# EAGLE design rfm69_32u4 (EAGLE 8.2.2)
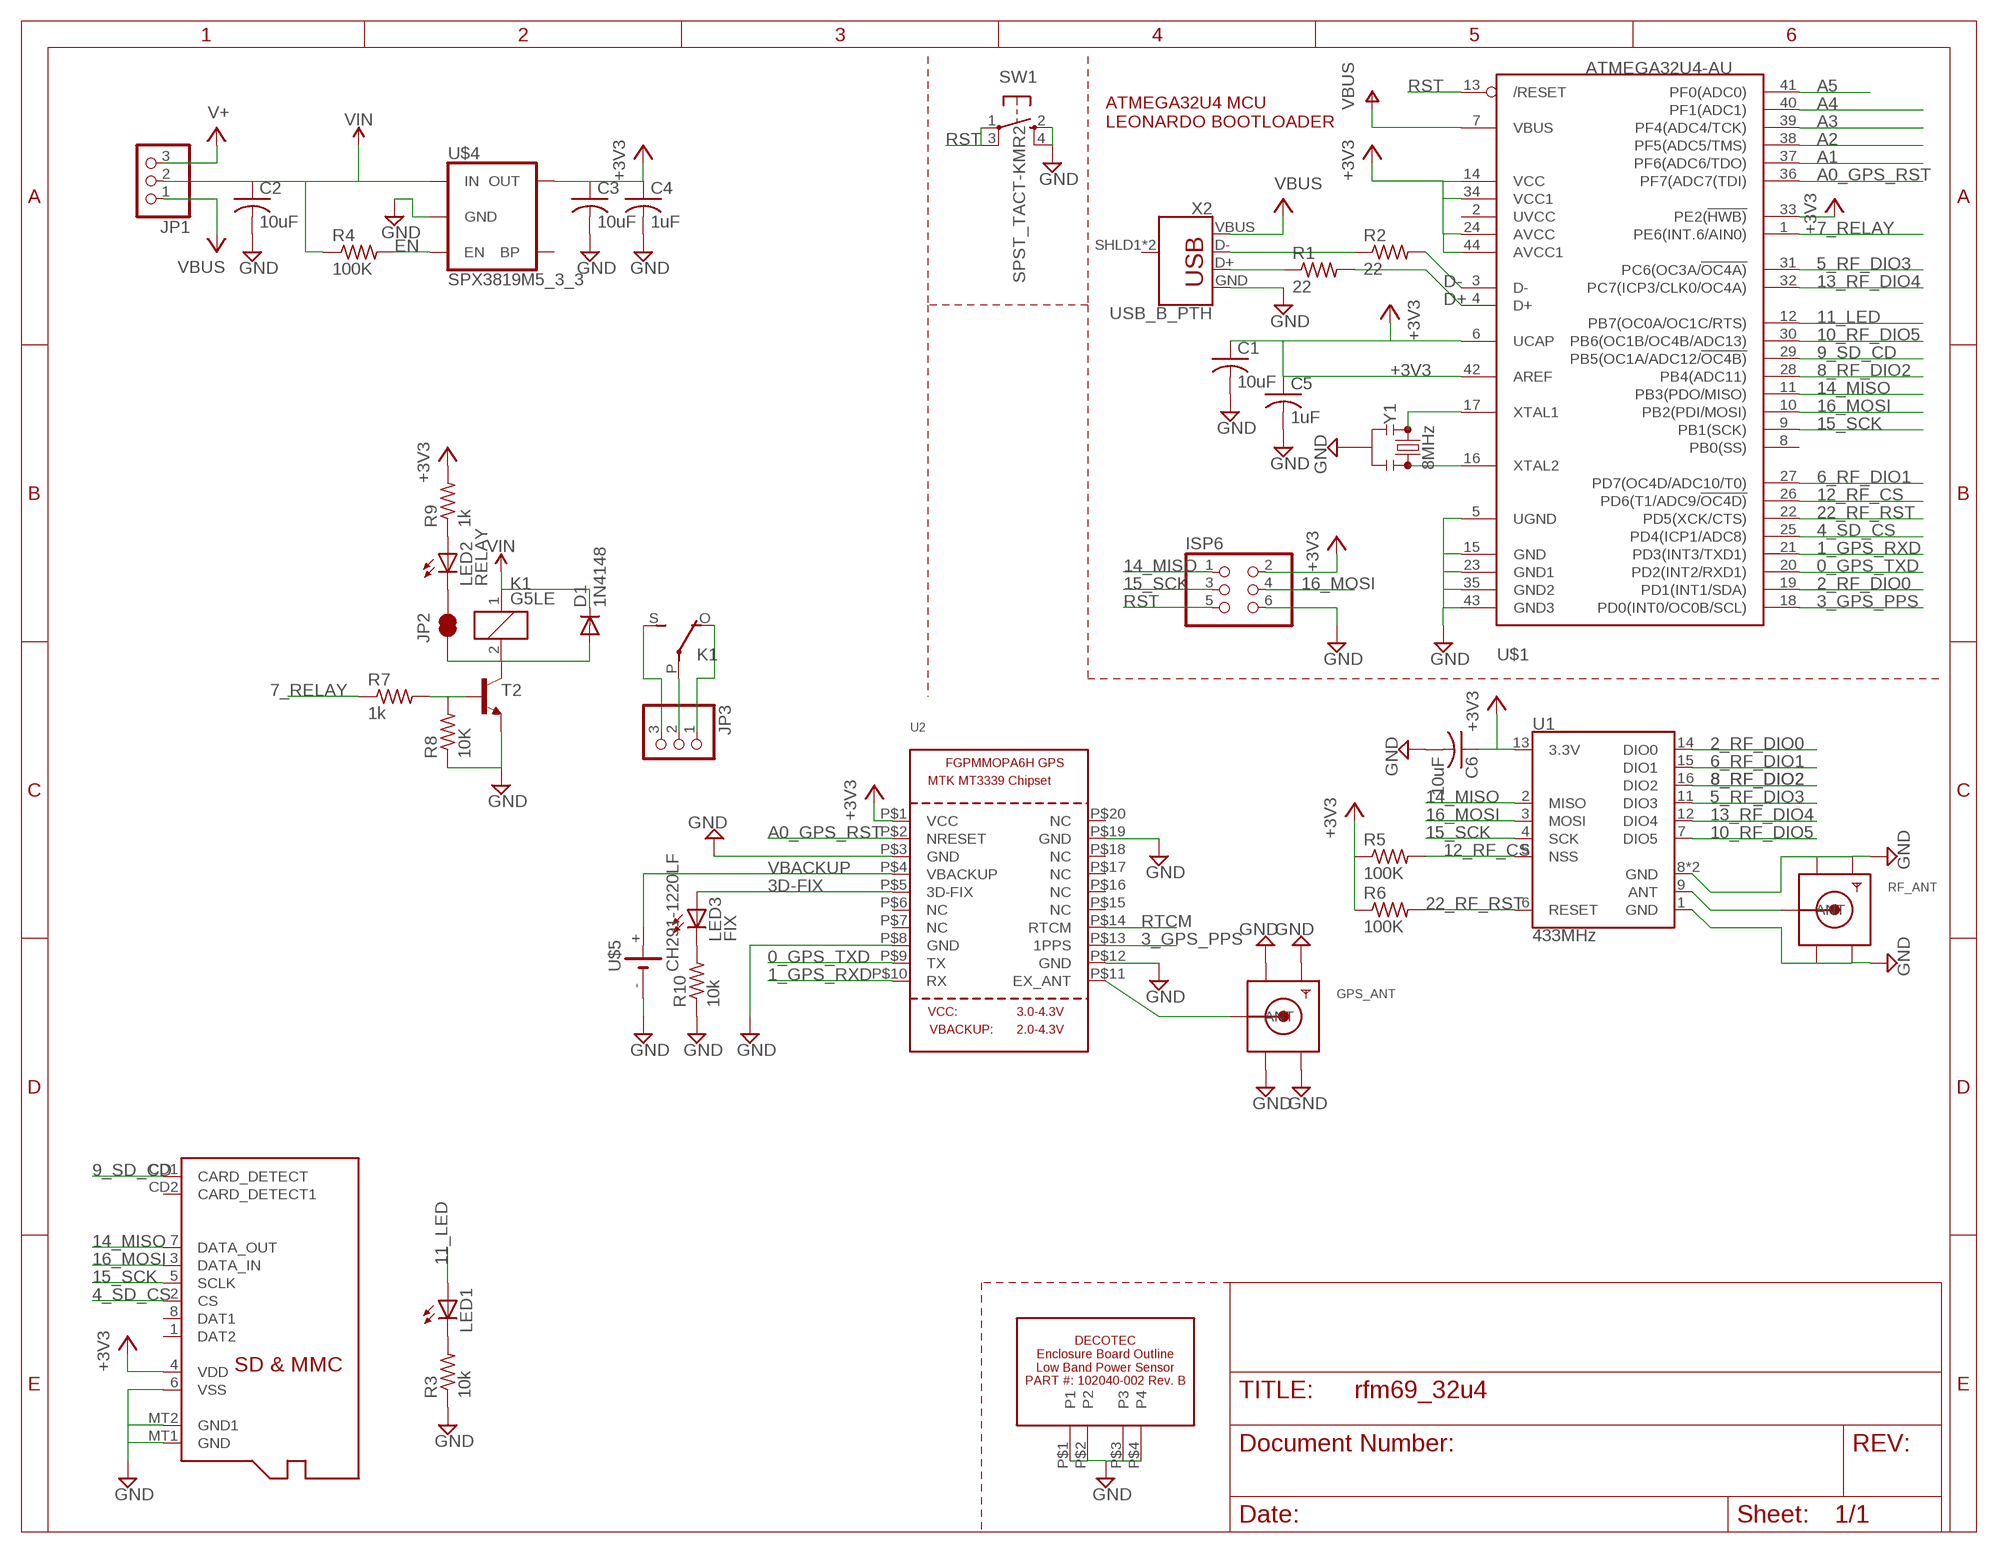
[diagram p0: schematic, sheet 1]

## Parts
C1  10uF  C-USC0805K  [C0805K]
C2  10uF  C-USC0805K  [C0805K]
C3  10uF  C-USC0805K  [C0805K]
C4  1uF  C-USC0805K  [C0805K]
C5  1uF  C-USC0805K  [C0805K]
C6  10uF  C-USC0805K  [C0805K]
D1  1N4148  DIODE-SOD323-R  [SOD323-R]
GPS_ANT  SMACONNECTOR_EDGE  [SMA_EDGELAUNCH]
ISP6  PINHD-2X3  [2X03]
JP1  PINHD-1X3  [1X03]
JP2  JUMPER-SMT_2_NC_TRACE_SILK  [SMT-JUMPER_2_NC_TRACE_SILK]
JP3  PINHD-1X3  [1X03]
K1  G5LE  [G5LE]
LED1  LEDCHIPLED_0805  [CHIPLED_0805]
LED2  RELAY  LEDCHIPLED_0805  [CHIPLED_0805]
LED3  FIX  LEDCHIPLED_0805  [CHIPLED_0805]
R1  22  R-US_R0805  [R0805]
R2  22  R-US_R0805  [R0805]
R3  10k  R-US_R0805  [R0805]
R4  100K  R-US_R0805  [R0805]
R5  100K  R-US_R0805  [R0805]
R6  100K  R-US_R0805  [R0805]
R7  1k  R-US_R0805  [R0805]
R8  10K  R-US_R0805  [R0805]
R9  1k  R-US_R0805  [R0805]
R10  10k  R-US_R0805  [R0805]
RF_ANT  SMACONNECTOR_EDGE  [SMA_EDGELAUNCH]
SW1  SPST_TACT-KMR2  [KMR2]
T2  MMBT2222ALT1-NPN-SOT23-BEC  [SOT23-BEC]
U1  433MHz  RFM69HCW-433  [RFM69HCW-XXXS2]
U2  GPS_FGPMMOPA6H  [FGPMMOPA6H]
U$1  ATMEGA32U4-AU  [TQFP44]
U$2  DECOTEC_102040-002B  [DECOTEC_102040-002B]
U$3  MICROSD  [MICROSD]
U$4  SPX3819M5_3_3  V_REG_SPX3819-SOT23-5  [SOT23-5]
U$5  CH291-1220LF  [CH291-1220LF]
X2  USB_B_PTH  [USB-B-PTH]
Y1  8MHz  RESONATOR-8MHZSMD_3.2X1.3  [RESONATOR-SMD-3.2X1.3]

## Nets
0_GPS_TXD: U2.P$9(TX) U$1.20(PD2(INT2/RXD1))
1_GPS_RXD: U2.P$10(RX) U$1.21(PD3(INT3/TXD1))
2_RF_DIO0: U1.14(DIO0) U$1.19(PD1(INT1/SDA))
3_GPS_PPS: U2.P$13(1PPS) U$1.18(PD0(INT0/OC0B/SCL))
3D-FIX: LED3.A U2.P$5(3D-FIX)
4_SD_CS: U$1.25(PD4(ICP1/ADC8)) U$3.2(CS)
5_RF_DIO3: U1.11(DIO3) U$1.31(PC6(OC3A/!OC4A))
6_RF_DIO1: U1.15(DIO1) U$1.27(PD7(OC4D/ADC10/T0))
7_RELAY: R7.1 U$1.1(PE6(INT.6/AIN0))
8_RF_DIO2: U1.16(DIO2) U$1.28(PB4(ADC11))
9_SD_CD: U$1.29(PB5(OC1A/ADC12/!OC4B)) U$3.CD1(CARD_DETECT)
10_RF_DIO5: U1.7(DIO5) U$1.30(PB6(OC1B/OC4B/ADC13))
11_LED: LED1.A U$1.12(PB7(OC0A/OC1C/RTS))
12_RF_CS: R5.2 U1.5(NSS) U$1.26(PD6(T1/ADC9/!OC4D))
13_RF_DIO4: U1.12(DIO4) U$1.32(PC7(ICP3/CLK0/OC4A))
14_MISO: ISP6.1 U1.2(MISO) U$1.11(PB3(PDO/MISO)) U$3.7(DATA_OUT)
15_SCK: ISP6.3 U1.4(SCK) U$1.9(PB1(SCK)) U$3.5(SCLK)
16_MOSI: ISP6.4 U1.3(MOSI) U$1.10(PB2(PDI/MOSI)) U$3.3(DATA_IN)
22_RF_RST: R6.2 U1.6(RESET) U$1.22(PD5(XCK/CTS))
+3V3: C1.1 C3.1 C4.1 C5.1 C6.1 ISP6.2 R5.1 R6.1 R9.2 U1.13(3.3V) U2.P$1(VCC) U$1.6(UCAP) U$1.14(VCC) U$1.24(AVCC) U$1.33(PE2(!HWB)) U$1.34(VCC1) U$1.42(AREF) U$1.44(AVCC1) U$3.4(VDD) U$4.5(OUT)
A0_GPS_RST: U2.P$2(NRESET) U$1.36(PF7(ADC7(TDI))
A1: U$1.37(PF6(ADC6/TDO))
A2: U$1.38(PF5(ADC5/TMS))
A3: U$1.39(PF4(ADC4/TCK))
A4: U$1.40(PF1(ADC1))
A5: U$1.41(PF0(ADC0))
ANT: RF_ANT.P(ANT) U1.9(ANT)
D+: R1.2 U$1.4(D+)
D-: R2.2 U$1.3(D-)
EN: R4.2 U$4.3(EN)
GND: C1.2 C2.2 C3.2 C4.2 C5.2 C6.2 GPS_ANT.GND@1(GND4) GPS_ANT.GND@2(GND3) GPS_ANT.GND@3(GND2) GPS_ANT.GND@4(GND1) ISP6.6 R3.1 R8.1 R10.1 RF_ANT.GND@1(GND4) RF_ANT.GND@2(GND3) RF_ANT.GND@3(GND2) RF_ANT.GND@4(GND1) SW1.2(S) SW1.4(S1) T2.E U1.1(GND) U1.8(GND) U1.10(GND) U2.P$3(GND) U2.P$8(GND) U2.P$12(GND) U2.P$19(GND) U$1.5(UGND) U$1.15(GND) U$1.23(GND1) U$1.35(GND2) U$1.43(GND3) U$2.P$1(P1) U$2.P$2(P2) U$2.P$3(P3) U$2.P$4(P4) U$3.6(VSS) U$3.MT1(GND) U$3.MT2(GND1) U$4.2(GND) U$5.- X2.GND Y1.2
N$1: R1.1 X2.D+
N$2: LED1.C R3.2
N$3: R2.1 X2.D-
N$4: D1.A JP2.1 K1.2 T2.C
N$5: LED3.C R10.2
N$7: GPS_ANT.P(ANT) U2.P$11(EX_ANT)
N$8: R7.2 R8.2 T2.B
N$9: LED2.A R9.1
N$10: JP2.2 LED2.C
N$12: JP3.2 K1.P(2:P)
N$13: JP3.1 K1.O(2:O)
N$14: JP3.3 K1.S(2:S)
RST: ISP6.5 SW1.1(P) SW1.3(P1) U$1.13(/RESET)
RTCM: U2.P$14(RTCM)
V+: JP1.3
VBACKUP: U2.P$4(VBACKUP) U$5.+
VBUS: JP1.1 U$1.7(VBUS) X2.VBUS
VIN: C2.1 D1.C JP1.2 K1.1 R4.1 U$4.1(IN)
XTAL1: U$1.17(XTAL1) Y1.1
XTAL2: U$1.16(XTAL2) Y1.3
Unconnected: U2.P$6(NC) U2.P$7(NC) U2.P$15(NC) U2.P$16(NC) U2.P$17(NC) U2.P$18(NC) U2.P$20(NC) U$1.2(UVCC) U$1.8(PB0(SS)) U$3.1(DAT2) U$3.8(DAT1) U$3.CD2(CARD_DETECT1) U$4.4(BP) X2.SHLD1(SHIELD) X2.SHLD2(SHIELD)

## Notes on the sheet
- ATMEGA32U4 MCU
  LEONARDO BOOTLOADER

## Library data of the parts
C1-C6 = rcl:C-US: CAPACITOR, American symbol
D1 = diode:DIODE-: DIODE
GPS_ANT RF_ANT = adafruit:SMACONNECTOR: SMA Connector 90° DIP SMA Connector, 50 Ohm (4UConnector: 07259)
ISP6 = pinhead:PINHD-2X3: PIN HEADER
JP1 JP3 = pinhead:PINHD-1X3: PIN HEADER
JP2 = SparkFun-Jumpers:JUMPER-SMT_2_NC_TRACE: Normally closed trace jumper This jumper has a trace between two pads so it's normally closed (NC). Use a razor knife to open the connection. For best results follow the IPC guidelines for cutting traces: Cutout at least 0.063 mm (0.005 in). Remove all loose material to clean up the cut area. Seal the cut with an approved epoxy. Reapply solder to reclose the connection.
K1 = relay:G5LE: RELAY 1 x switch, 10 A/120 V AC, 8 A/30 V DC, Omron; OC_FARNELL: unknown; OC_NEWARK: unknown
LED1-LED3 = adafruit:LED: LED OSRAM: - CHIPLED LG R971, LG N971, LY N971, LG Q971, LY Q971, LO R971, LY R971 LH N974, LH R974 LS Q976, LO Q976, LY Q976 LO Q996 - Hyper CHIPLED LW Q18S LB Q993, LB Q99A, LB R99A - SideLED LS A670, LO A670, LY A670, LG A670, LP A670 LB A673, LV A673, LT A673, LW A673 LH A674 LY A675 LS A676, LA A676, LO A676, LY A676, LW A676 LS A679, LY A679, LG A679 - Hyper Micro SIDELED® LS Y876, LA Y876, LO Y876, LY Y876 LT Y87S - SmartLED LW L88C, LW L88S LB L89C, LB L89S, LG L890 LS L89K, LO L89K, LY L89K LS L896, LA L896, LO L896, LY L896 - TOPLED LS T670, LO T670, LY T670, LG T670, LP T670 LSG T670, LSP T670, LSY T670, LOP T670, LYG T670 LG T671, LOG T671, LSG T671 LB T673, LV T673, LT T673, LW T673 LH T674 LS T676, LA T676, LO T676, LY T676, LB T676, LH T676, LSB T676, LW T676 LB T67C, LV T67C, LT T67C, LS T67K, LO T67K, LY T67K, LW E67C LS E67B, LA E67B, LO E67B, LY E67B, LB E67C, LV E67C, LT E67C LW T67C LS T679, LY T679, LG T679 LS T770, LO T770, LY T770, LG T770, LP T770 LB T773, LV T773, LT T773, LW T773 LH T774 LS E675, LA E675, LY E675, LS T675 LS T776, LA T776, LO T776, LY T776, LB T776 LHGB T686 LT T68C, LB T68C - Hyper Mini TOPLED® LB M676 - Mini TOPLED Santana® LG M470 LS M47K, LO M47K, LY M47K Source: http://www.osram.convergy.de/
R1-R10 = adafruit:R-US_: RESISTOR, American symbol
SW1 = adafruit:SPST_TACT: SMT 6mm switch, EVQQ2 series http://www.ladyada.net/library/eagle
T2 = transistor:*-NPN-: NPN Transistror BF959 corrected 2008.03.06
U1 = SparkFun-RF:RFM69H: Hope RF RFM69H ISM Transceiver Module The RFM69H is a transceiver module capable of operation over a wide frequency range, including the 315,433,868 and 915MHz license-free ISM (Industry Scientific and Medical) frequency bands. All major RF communication parameters are programmable and most of them can be dynamically set. The RFM69H offers the unique advantage of programmable narrow-band and wide- band communication modes. The RFM69H is optimized for low power consumption while offering high RF output power and channelized operation.Compliance ETSI and FCC regulations. Datasheet <http://www.hoperf.cn/upload/docs/RF/SX/RFM69H_DataSheet_v1.3.pdf> SparkFun Products RFM69HCW Wireless Transceiver - 915MHz <https://www.sparkfun.com/products/13909> (COM-13909) RFM69HCW Wireless Transceiver - 434MHz <https://www.sparkfun.com/products/13910> (COM-13910) SparkFun RFM69 Breakout (915MHz) <https://www.sparkfun.com/products/12775> (WRL-12775) SparkFun RFM69 Breakout (434MHz) <https://www.sparkfun.com/products/12823> (WRL-12823); PROD_ID: IC-12053
U2 = adafruit:GPS_FGPMMOPA6H: GPS Module - MTK MT3339 Chipset, -165dBm sensitivity, 22 channels, 10Hz, auto-select external antenna options
U$1 = adafruit:ATMEGA32U4: http://www.ladyada.net/library/eagle
U$2 = vtgs:DECOTEC_102040-002B
U$3 = adafruit:MICROSD: Micro-SD / Transflash card holder with SPI pinout For the 3M # 2908-05WB-MG and/or 4UCON #19656 push-push type
U$4 = SparkFun-IC-Power:V_REG_SPX3819: SPX3819 Voltage Regulator 3.3V 500mA, 16V input Datasheet <https://www.exar.com/content/document.ashx?id=22106> SparkFun Products: SparkFun Serial Controlled Motor Driver <https://www.sparkfun.com/products/13911>; PROD_ID: VREG-13321
U$5 = battery:CH291-1220LF: Battery Holder, SMT, 12mm multicomp PART NO. CH291-1220LF Source: Data sheet <http://www.farnell.com/datasheets/1505860.pdf>
X2 = SparkFun-Connectors:USB_B: USB Type B Connector SparkFun Products: SparkFun Stepoko <https://www.sparkfun.com/products/13899> PTH; PROD_ID: CONN-08278; SF_ID: PRT-00139
Y1 = SparkFun-Clocks:RESONATOR-8MHZ: 8MHz Resonator Digikey Example <http://www.digikey.com/product-detail/en/murata-electronics-north-america/CSTCE10M0G55-R0/490-1196-1-ND/584633> Frequency: 8MHz Frequency Stability: ±0.2% Frequency Tolerance: ±0.5% Capacitance: 33pF SparkFun Products Arduino Pro Mini 328- 3.3V/8MHz <https://www.sparkfun.com/products/11114> SparkFun Digital Sandbox <https://www.sparkfun.com/products/12651>; PROD_ID: XTAL-08895

## Board
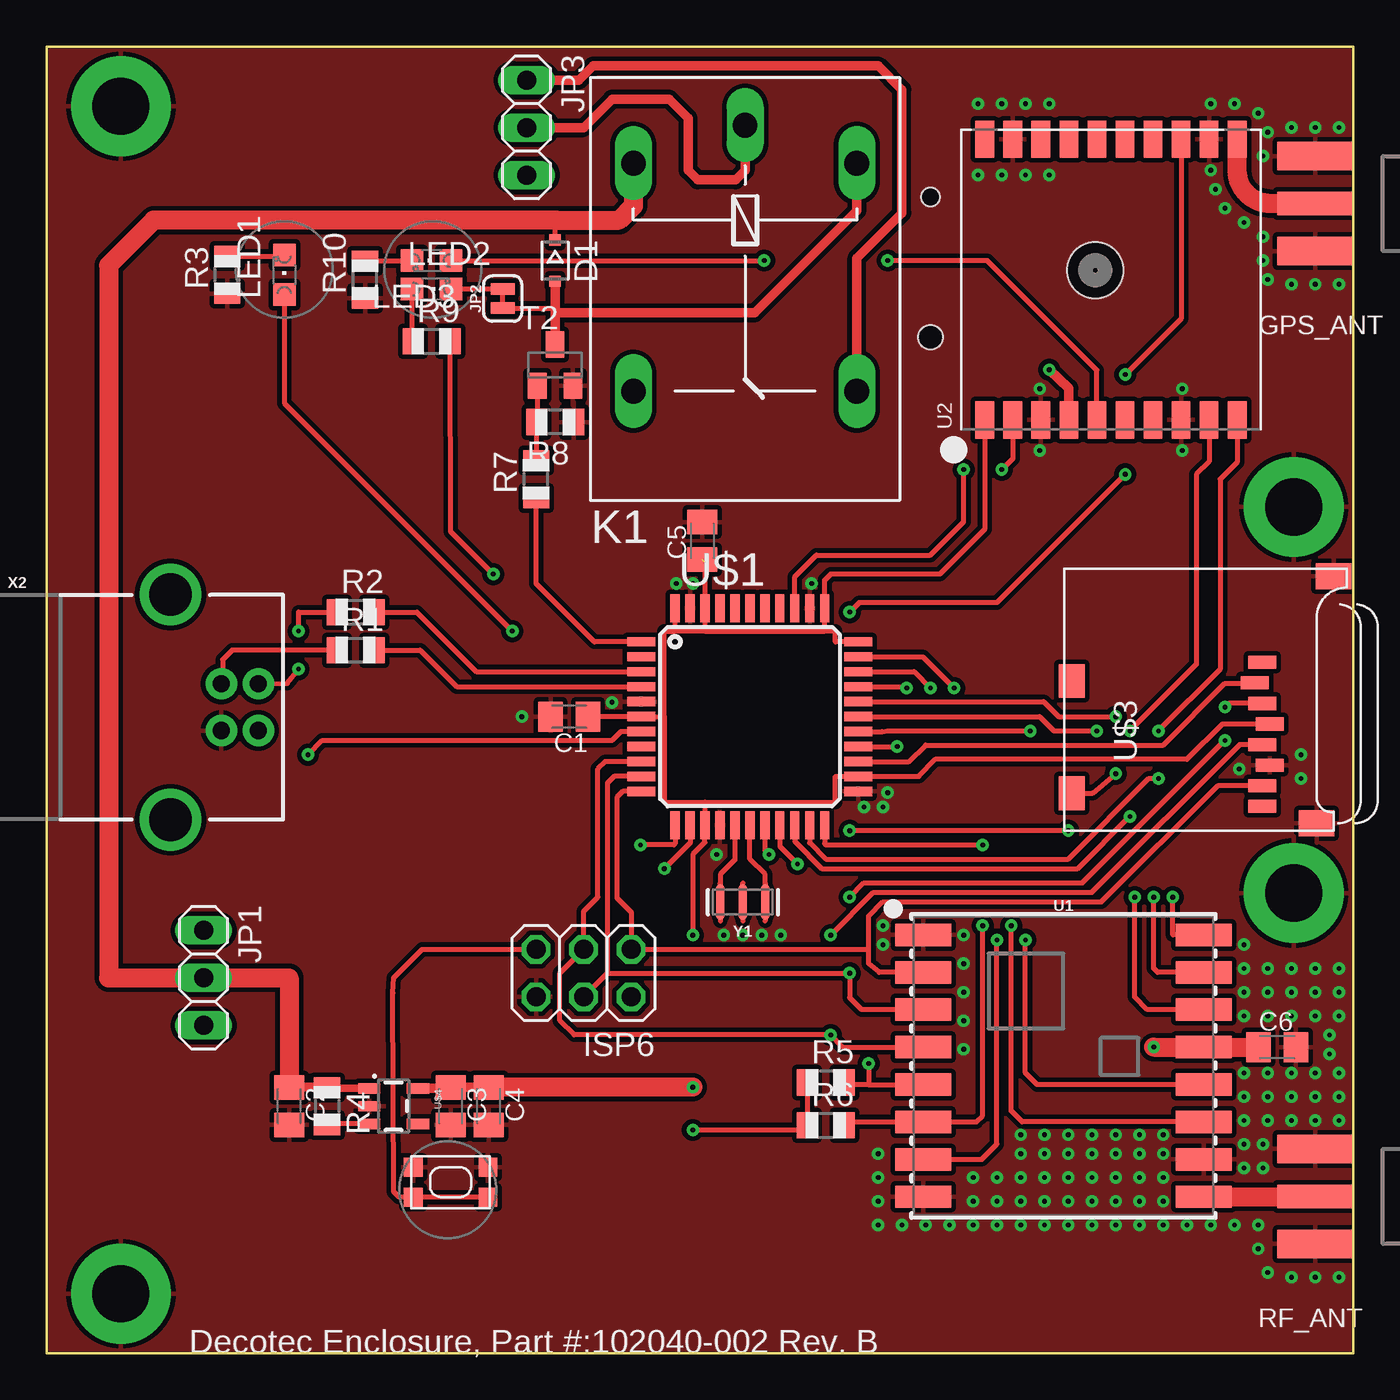
[diagram p1: board, top side]
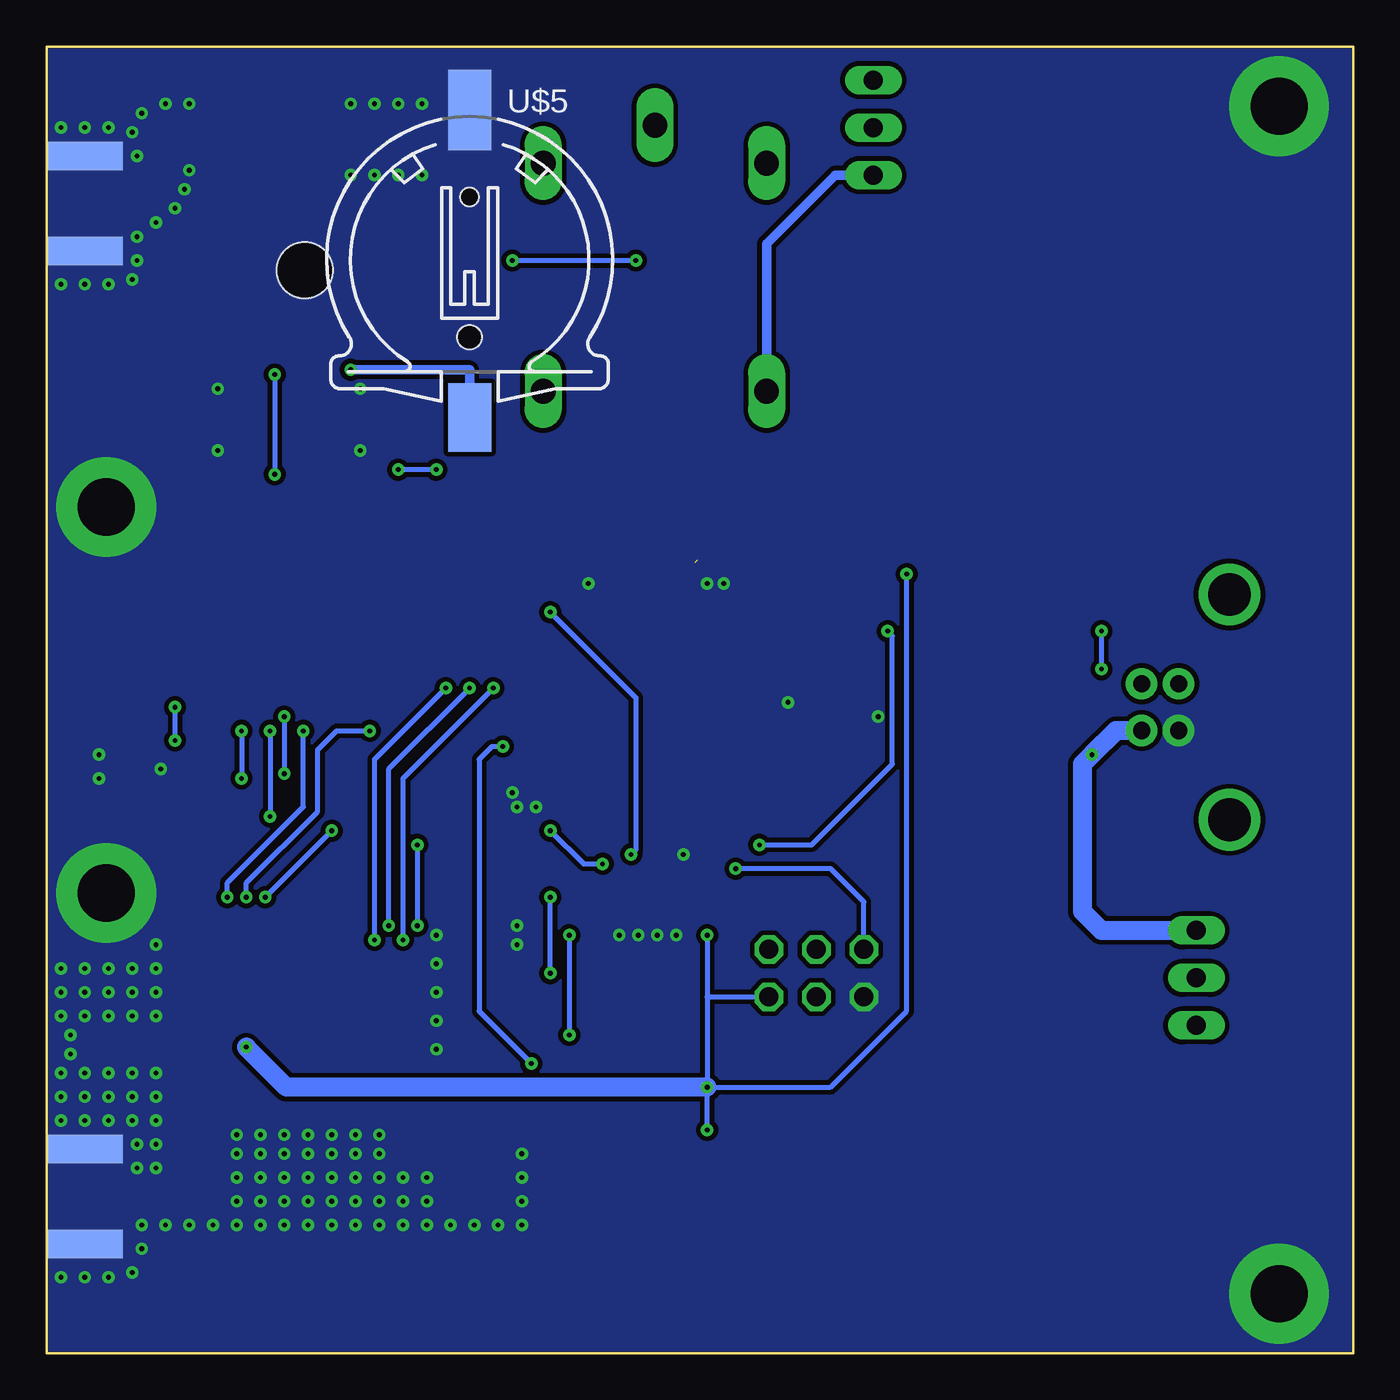
[diagram p2: board, bottom side, seen from below]

Size 69.85 x 69.85 mm. Coordinates in mm from the lower left corner, seen from the top.
Copper layers (1*16): Top 0.035mm / dielectric 1.5mm / Bottom 0.035mm
Design rules "default *": minimum track width 6mil, minimum drill 10mil, track to track 10mil, track to pad 6mil, pad to pad 6mil, via to via 6mil, smd to smd 6mil, copper to edge 1mil, drill to drill 6mil, minimum pad ring 10mil, minimum via ring 8mil, stop-mask expansion 4mil, vias tented up to drill 0mil, thermal gap 10mil

### Footprints (pad centres in the part's own frame; a part is rotated, then mirrored left to right if it is on the bottom)
C0805K = smd 1.3 x 1.6: 1 -1,0; 2 1,0
SOD323-R = smd 0.6 x 0.6: A 1.1,0; C -1.1,0
SMA_EDGELAUNCH = smd 4.064 x 1.524: GND@1 2.032,-2.54; GND@2 2.032,2.54 | smd 4.064 x 1.524 bottom: GND@3 2.032,2.54; GND@4 2.032,-2.54 | smd 4.064 x 1.27: P 2.032,0
2X03 = drill 1.016 octagon: 1 -2.54,-1.27; 2 -2.54,1.27; 3 0,-1.27; 4 0,1.27; 5 2.54,-1.27; 6 2.54,1.27
1X03 = drill 1.016 long: 1 -2.54,0; 2 0,0; 3 2.54,0
SMT-JUMPER_2_NC_TRACE_SILK = smd 0.635 x 1.27: 1 -0.508,0; 2 0.508,0
G5LE = drill 1.321 long: 1 -7.493,-5.969; 2 -7.493,5.969; O 4.699,5.969; P -9.525,0; S 4.699,-5.969
CHIPLED_0805 = smd 1.2 x 1.2: A 0,-1.05; C 0,1.05
R0805 = smd 1.1 x 1.4: 1 -1,0; 2 1,0
KMR2 = smd 1 x 1: 1 2,0.8; 2 2,-0.8; 3 -2,0.8; 4 -2,-0.8
SOT23-BEC = smd 1 x 1.4: B -0.95,-1.1; C 0,1.1; E 0.95,-1.1
RFM69HCW-XXXS2 = smd 3 x 1.2: 1 -7.5,7; 2 -7.5,5; 3 -7.5,3; 4 -7.5,1; 5 -7.5,-1; 6 -7.5,-3; 7 -7.5,-5; 8 -7.5,-7; 9 7.5,-7; 10 7.5,-5; 11 7.5,-3; 12 7.5,-1; 13 7.5,1; 14 7.5,3; 15 7.5,5; 16 7.5,7
FGPMMOPA6H = smd 2 x 1: P$1 -7.5,6.75; P$2 -7.5,5.25; P$3 -7.5,3.75; P$4 -7.5,2.25; P$5 -7.5,0.75; P$6 -7.5,-0.75; P$7 -7.5,-2.25; P$8 -7.5,-3.75; P$9 -7.5,-5.25; P$10 -7.5,-6.75; P$11 7.5,-6.75; P$12 7.5,-5.25; P$13 7.5,-3.75; P$14 7.5,-2.25; P$15 7.5,-0.75; P$16 7.5,0.75; P$17 7.5,2.25; P$18 7.5,3.75; P$19 7.5,5.25; P$20 7.5,6.75 | hole 3: 0.5,0.85
TQFP44 = smd 1.5 x 0.5: 1 -5.8,4; 2 -5.8,3.2; 3 -5.8,2.4; 4 -5.8,1.6; 5 -5.8,0.8; 6 -5.8,0; 7 -5.8,-0.8; 8 -5.8,-1.6; 9 -5.8,-2.4; 10 -5.8,-3.2; 11 -5.8,-4; 23 5.8,-4; 24 5.8,-3.2; 25 5.8,-2.4; 26 5.8,-1.6; 27 5.8,-0.8; 28 5.8,0; 29 5.8,0.8; 30 5.8,1.6; 31 5.8,2.4; 32 5.8,3.2; 33 5.8,4 | smd 0.5 x 1.5: 12 -4,-5.8; 13 -3.2,-5.8; 14 -2.4,-5.8; 15 -1.6,-5.8; 16 -0.8,-5.8; 17 0,-5.8; 18 0.8,-5.8; 19 1.6,-5.8; 20 2.4,-5.8; 21 3.2,-5.8; 22 4,-5.8; 34 4,5.8; 35 3.2,5.8; 36 2.4,5.8; 37 1.6,5.8; 38 0.8,5.8; 39 0,5.8; 40 -0.8,5.8; 41 -1.6,5.8; 42 -2.4,5.8; 43 -3.2,5.8; 44 -4,5.8
DECOTEC_102040-002B = drill 3.048 pad 5.334: P$1 3.969,3.175; P$2 3.969,66.675; P$3 66.675,45.244; P$4 66.675,24.606
MICROSD = smd 0.7 x 1.5: 1 9,-10.64; 2 7.9,-10.24; 3 6.8,-10.64; 4 5.7,-11.04; 5 4.6,-10.64; 6 3.5,-11.04; 7 2.4,-10.64; 8 1.3,-10.64 | smd 1.8 x 1.4: CD1 2,-0.44; CD2 8,-0.44 | smd 1.4 x 1.9: MT1 0.4,-13.54; MT2 13.6,-14.44
SOT23-5 = smd 0.55 x 1.2: 1 -0.95,-1.3; 2 0,-1.3; 3 0.95,-1.3; 4 0.95,1.3; 5 -0.95,1.3
CH291-1220LF = smd 2.3 x 3.66: + 0,-2.296 | smd 2.3 x 4.3: - 0,14.146 | hole 1.3: 0,2 | hole 1: 0,9.5
USB-B-PTH = drill 0.914 pad 1.676: D+ 4,1.25; D- 5.981,1.25; GND 4,-1.25; VBUS 5.981,-1.25 | drill 2.286: SHLD1 1.282,-6.02; SHLD2 1.282,6.02
RESONATOR-SMD-3.2X1.3 = smd 0.45 x 1.905: 1 -1.2,0; 2 0,0; 3 1.2,0

### Placement (x,y rotation side)
C1  27.94,34.04 180 top
C2  12.95,13.21 270 top
C3  21.59,13.21 270 top
C4  23.62,13.21 270 top
C5  35.05,43.43 90 top
C6  65.79,16.37 0 top
D1  27.18,58.42 270 top
GPS_ANT  69.85,61.47 180 top
ISP6  28.7,20.32 180 top
JP1  8.38,20.07 270 top
JP2  24.38,56.39 90 top
JP3  25.65,65.53 270 top
K1  37.34,56.13 270 top
LED1  12.7,57.66 0 top
LED2  20.57,56.9 270 top
LED3  20.57,58.42 90 top
R1  16.51,37.59 0 top
R2  16.51,39.62 0 top
R3  9.65,57.66 90 top
R4  14.99,13.21 270 top
R5  41.66,14.48 0 top
R6  41.66,12.19 0 top
R7  26.16,46.74 90 top
R8  27.18,49.78 180 top
R9  20.57,54.1 0 top
R10  17.02,57.4 90 top
RF_ANT  69.85,8.38 180 top
SW1  21.59,9.14 180 top
T2  27.18,52.83 0 top
U1  54.36,15.37 0 top
U2  56.9,57.4 90 top
U$1  37.59,34.04 0 top
U$2  0,0 0 top
U$3  54.36,27.94 90 top
U$4  18.54,13.21 270 top
U$5  47.24,52.32 0 bottom
X2  5.33,34.54 0 top
Y1  37.21,24.13 180 top

### Tracks (layer width: path | path; a pad name or v marks a point on that pad's centre or on a via)
0_GPS_TXD  (via drill 0.25)
  Top 0.254: U2.P$9 62.15,47.67 61.47,46.99 61.47,36.83 v57.91,33.27 | U$1.20 39.99,27.36 41.45,25.91 55.12,25.91 v57.91,28.7
  Bottom 0.254: v57.91,33.27 v57.91,28.7
1_GPS_RXD  (via drill 0.25)
  Top 0.254: U2.P$10 63.65,47.64 62.74,46.74 62.74,36.58 v59.44,33.27 | U$1.21 40.79,27.28 41.66,26.42 54.61,26.42 58.93,30.73 v59.44,30.73
  Bottom 0.254: v59.44,33.27 v59.44,30.73
2_RF_DIO0  (via drill 0.25)
  Top 0.254: U1.14 58.85,18.37 58.17,19.05 v58.17,24.38 | U$1.19 39.19,27.1 v40.13,26.16 | v54.61,27.94 v42.93,27.94
  Bottom 0.254: v58.17,24.38 v54.61,27.94 | v42.93,27.94 41.15,26.16 v40.13,26.16
3_GPS_PPS  (via drill 0.25)
  Top 0.254: U$1.18 38.39,26.89 v38.61,26.67 | U2.P$13 60.65,55.31 v57.66,52.32 | v57.66,46.99 50.8,40.13 43.43,40.13 v42.93,39.62
  Bottom 0.254: v38.61,26.67 38.35,26.92 38.35,35.05 v42.93,39.62 | v57.66,52.32 v57.66,46.99
3D-FIX  (via drill 0.25)
  Top 0.254: U2.P$5 56.15,52.57 50.29,58.42 v44.96,58.42 | LED3.A v38.35,58.42
  Bottom 0.254: v38.35,58.42 v44.96,58.42
4_SD_CS
  Top 0.254: U$1.25 46.09,31.64 46.99,32.51 59.69,32.51 62.99,35.81 64.57,35.81 U$3.2
5_RF_DIO3  (via drill 0.25)
  Top 0.254: U1.11 52.15,12.37 51.56,12.95 v51.56,22.86 | U$1.31 46.37,36.44 v47.24,35.56
  Bottom 0.254: v51.56,22.86 51.56,31.24 v47.24,35.56
6_RF_DIO1  (via drill 0.25)
  Top 0.254: v59.18,24.38 59.18,20.57 59.39,20.37 U1.15 | U$1.27 44.67,33.24 44.96,33.27 v52.58,33.27
  Bottom 0.254: v59.18,24.38 59.18,25.15 55.37,28.96 55.37,32.26 54.36,33.27 v52.58,33.27
7_RELAY
  Top 0.254: U$1.1 29.27,38.04 26.16,41.15 R7.1
8_RF_DIO2  (via drill 0.25)
  Top 0.254: U1.16 60.21,22.37 v60.2,24.38 | U$1.28 53.09,34.04 53.85,33.27 v56.13,33.27
  Bottom 0.254: v60.2,24.38 60.2,25.15 56.13,29.21 v56.13,33.27
9_SD_CD  (via drill 0.25)
  Top 0.254: U$3.CD1 55.91,29.94 v57.15,30.99 | U$1.29 53.3,34.84 54.1,34.04 v57.15,34.04
  Bottom 0.254: v57.15,34.04 v57.15,30.99
10_RF_DIO5  (via drill 0.25)
  Top 0.254: U1.7 49.99,10.37 50.8,11.18 v50.8,22.1 | U$1.30 45.9,35.64 v45.97,35.56
  Bottom 0.254: v50.8,22.1 50.8,30.73 v45.97,35.56
11_LED  (via drill 0.25)
  Top 0.254: U$1.12 33.59,27.24 33.53,27.18 v31.75,27.18 | LED1.A 12.7,50.8 v24.89,38.61
  Bottom 0.254: v31.75,27.18 28.96,27.18 24.64,31.5 24.64,38.35 v24.89,38.61
12_RF_CS  (via drill 0.25)
  Top 0.254: 43.92,14.37 42.77,14.37 R5.2 | 43.92,14.37 U1.5 | U$1.26 v45.47,32.44 | v43.94,15.49 43.94,14.39 43.92,14.37
  Bottom 0.254: v43.94,15.49 46.74,18.29 46.74,31.75 46.05,32.44 v45.47,32.44
13_RF_DIO4  (via drill 0.25)
  Top 0.254: U1.12 52.94,14.37 52.32,14.99 v52.32,22.1 | U$1.32 46.84,37.24 v48.51,35.56
  Bottom 0.254: v52.32,22.1 52.32,31.75 v48.51,35.56
14_MISO
  Top 0.254: U1.2 44.5,20.37 43.94,20.83 43.94,21.59 | 43.94,21.59 ISP6.1 31.24,23.58 30.48,24.34 30.48,29.72 30.8,30.04 U$1.11 | U$3.7 62.6,30.34 56.39,24.13 44.7,24.13 43.94,23.37 43.94,21.59
15_SCK  (via drill 0.25)
  Top 0.254: U$1.9 29.86,31.64 29.46,31.24 29.46,24.38 28.7,23.62 ISP6.3 27.43,20.32 27.43,17.78 28.19,17.02 v41.91,17.02 42.56,16.37 U1.4 | U$3.5 63.78,32.54 55.88,24.64 44.2,24.64 v41.91,22.35
  Bottom 0.254: v41.91,22.35 v41.91,17.02
16_MOSI  (via drill 0.25)
  Top 0.254: 29.97,20.32 29.97,30.48 30.33,30.84 U$1.10 | 29.97,20.32 v42.93,20.32 42.93,19.01 43.56,18.37 U1.3 | 29.97,20.32 ISP6.4 | v42.93,24.38 43.69,25.15 55.37,25.15 v62.99,32.77 | U$3.3 63.19,34.74 v62.99,34.54
  Bottom 0.254: v42.93,20.32 v42.93,24.38 | v62.99,32.77 v62.99,34.54
22_RF_RST  (via drill 0.25)
  Top 0.254: U$1.22 41.59,27.24 41.66,27.18 v50.04,27.18 | R6.2 42.83,12.37 U1.6 49.7,12.37 50.04,12.7 v50.04,22.86
  Bottom 0.254: v50.04,27.18 v50.04,22.86
+3V3  (via drill 0.25)  (1 unrouted)
  Top 0.254: 40.66,14.39 R6.1 40.4,11.94 v34.54,11.94 | 40.66,14.39 R5.1 | 40.66,14.39 40.64,14.4 | C1.1 U$1.6 33.02,34.04 | v34.54,22.35 34.54,26.67 35.19,27.32 U$1.14 35.19,29.46 | 35.19,42.29 U$1.42 35.19,38.61 | 35.19,29.46 33.02,29.46 33.02,34.04 | 33.59,38.61 U$1.44 | 35.19,29.46 42.16,29.46 42.16,30.84 U$1.24 46.61,30.84 46.62,30.85 47.5,31.75 60.96,31.75 62.85,33.64 U$3.4 | 33.02,34.04 33.02,38.61 33.59,38.61 | U$1.33 42.16,38.04 42.16,38.61 41.59,38.61 | 35.19,38.61 41.59,38.61 | 35.19,38.61 33.59,38.61 | 41.59,38.61 U$1.34 41.59,41.34 41.91,41.66 47.75,41.66 50.15,44.05 U2.P$1 | v23.88,41.66 21.59,43.93 R9.2
  Top 0.508: U$4.5 21.29,14.16 C3.1 C4.1
  Top 1.016: C6.1 U1.13 v59.18,16.37 | v34.54,14.22 23.64,14.22 C4.1
  Bottom 0.254: v34.54,22.35 34.54,19.05 | 34.54,19.05 v34.54,14.22 | 34.54,19.05 ISP6.2 | v34.54,11.94 v34.54,14.22 | v34.54,14.22 27.94,14.22 23.88,18.29 v23.88,41.66
  Bottom 1.016: v34.54,14.22 57.04,14.22 v59.18,16.37
A0_GPS_RST  (via drill 0.25)
  Top 0.254: U$1.36 39.99,41.52 41.15,42.67 47.24,42.67 49.02,44.45 v49.02,47.24 | U2.P$2 51.65,47.84 v51.05,47.24
  Bottom 0.254: v49.02,47.24 v51.05,47.24
ANT
  Top 0.152: 67.8,8.37 RF_ANT.P
  Top 1.016: U1.9 67.8,8.37
D+
  Top 0.254: U$1.4 21.92,35.64 19.96,37.59 R1.2
D-
  Top 0.254: U$1.3 22.97,36.44 19.79,39.62 R2.2
EN
  Top 0.254: U$4.3 15.29,12.26
  Top 0.508: 15.29,12.26 R4.2
GND  (via drill 0.25)
  other vias: 35.81,26.67 25.4,34.04 30.23,34.8 37.21,22.35 63.75,31.24 67.06,32 67.06,30.73 44.7,22.86 44.7,21.84 49.02,22.35 44.45,10.67 44.45,9.4 44.45,8.13 44.45,6.86 45.72,6.86 46.99,6.86 48.26,6.86 49.53,6.86 50.8,6.86 52.07,6.86 53.34,6.86 54.61,6.86 55.88,6.86 57.15,6.86 58.42,6.86 59.69,6.86 60.96,6.86 62.23,6.86 63.5,6.86 64.77,6.86 64.77,5.59 49.78,62.99 51.05,62.99 52.32,62.99 53.59,62.99 49.78,66.8 51.05,66.8 52.32,66.8 53.59,66.8 62.23,63.25 62.48,62.23 62.99,61.21 64.01,60.45 65.02,59.69 65.02,58.42 65.28,57.4 62.23,66.8 63.5,66.8 64.77,66.29 65.28,65.28 66.55,65.53 67.82,65.53 69.09,65.53 66.55,57.15 67.82,57.15 69.09,57.15 65.02,64.01 44.96,29.97 44.7,29.21 43.69,29.21 53.09,51.56 53.09,48.26 60.71,48.26 60.71,51.56 40.89,41.15 34.54,41.15 36.2,22.35 38.23,22.35 39.24,22.35 33.66,41.15 49.02,20.83 49.02,19.3 49.02,17.78 49.02,16.26 49.53,8.13 49.53,9.4 50.8,9.4 52.07,9.4 53.34,9.4 54.61,9.4 50.8,8.13 52.07,8.13 53.34,8.13 54.61,8.13 55.88,8.13 55.88,9.4 57.15,9.4 58.42,9.4 59.69,9.4 59.69,8.13 58.42,8.13 57.15,8.13 52.07,10.67 53.34,10.67 53.34,11.68 52.07,11.68 54.61,11.68 55.88,11.68 57.15,11.68 58.42,11.68 59.69,11.68 59.69,10.67 58.42,10.67 57.15,10.67 55.88,10.67 54.61,10.67 65.28,4.32 67.82,4.06 69.09,4.06 66.55,4.06 64.01,9.91 64.01,11.18 64.01,12.45 65.02,9.91 65.02,11.18 65.28,12.45 67.82,12.45 69.09,12.45 66.55,12.45 69.09,13.72 67.82,13.72 66.55,13.72 65.28,13.72 64.01,13.72 69.09,14.99 67.82,14.99 66.55,14.99 65.28,14.99 64.01,14.99 68.58,17.02 69.09,18.03 69.09,19.3 69.09,20.57 64.01,18.03 64.01,19.3 64.01,20.57 64.01,21.84 65.28,20.57 66.55,20.57 67.82,20.57 65.28,19.3 65.28,18.03 66.55,18.03 66.55,19.3 67.82,19.3 67.82,18.03 68.58,16
  pour Bottom (no thermals): 0,0 0,69.85 69.85,69.85 69.85,0
  pour Top: 0,0 0,69.85 69.85,69.85 69.85,0
N$1
  Top 0.254: R1.1 9.91,37.59 9.4,37.08 9.4,35.6 X2.D+
N$2
  Top 0.254: R3.2 12.65,58.66 LED1.C
N$3  (via drill 0.25)
  Top 0.254: v13.46,38.61 13.46,39.62 R2.1 | X2.D- 12.86,35.81 v13.46,36.58
  Bottom 0.254: v13.46,38.61 v13.46,36.58
N$4
  Top 0.254: JP2.1 27.17,55.88 27.18,55.88
  Top 0.508: K1.2 43.31,61.09 37.85,55.63 27.18,55.63 | D1.A 27.18,55.88 27.18,55.63 | T2.C 27.18,55.63
N$5
  Top 0.254: R10.2 19.51,58.4 LED3.C
N$7
  Top 1.016: GPS_ANT.P 65.42,61.47 arc-90 63.65,63.25 U2.P$11
N$8
  Top 0.254: 26.16,49.77 R7.2 | 26.16,49.77 R8.2 | T2.B 26.23,49.83 26.16,49.77
N$9
  Top 0.254: LED2.A 19.52,54.15 R9.1
N$10
  Top 0.254: JP2.2 LED2.C
N$12
  Top 0.508: K1.P 37.34,63.25 36.83,62.74 34.8,62.74 34.29,63.25 34.29,66.04 33.27,67.06 30.23,67.06 28.7,65.53 JP3.2
N$13
  Top 0.508: JP3.1 28.45,68.07 29.21,68.83 44.45,68.83 45.72,67.56 45.72,60.96 43.31,58.55 K1.O
N$14
  Bottom 0.508: JP3.3 27.69,62.99 31.37,59.31 K1.S
RST  (via drill 0.25)
  Top 0.254: SW1.3 SW1.1 18.83,8.34 18.54,8.64 18.51,19.27 18.54,20.07 20.07,21.59 ISP6.5 | U$1.13 34.39,27.28 v33.02,25.91
  Bottom 0.254: ISP6.5 26.16,24.13 27.94,25.91 v33.02,25.91
VBACKUP  (via drill 0.25)
  Top 0.508: U2.P$4 54.65,51.6 v53.59,52.58
  Bottom 0.508: U$5.+ 47.24,52.58 v53.59,52.58
VBUS  (via drill 0.25)
  Top 0.254: U$1.7 30.7,33.24 30.23,32.77 14.73,32.77 v13.97,32
  Bottom 1.016: JP1.1 13.46,22.61 14.48,23.62 14.48,31.5 v13.97,32 12.68,33.29 X2.VBUS
VIN
  Top 0.254: 15.04,14.16 R4.1 | D1.C 27.18,60.76 27.25,60.58
  Top 0.406: U$4.1 15.04,14.16
  Top 0.508: C2.1 12.95,14.24 R4.1
  Top 1.016: C2.1 12.95,20.07 JP1.2 3.3,20.07 3.3,58.17 5.71,60.58 27.25,60.58 30.61,60.58 31.37,61.34 K1.1
XTAL1
  Top 0.254: U$1.17 37.59,26.42 38.41,25.6 Y1.1
XTAL2
  Top 0.254: Y1.3 36.01,25.6 36.79,26.38 U$1.16